# EAGLE design 003-UI (EAGLE 9.6.2)
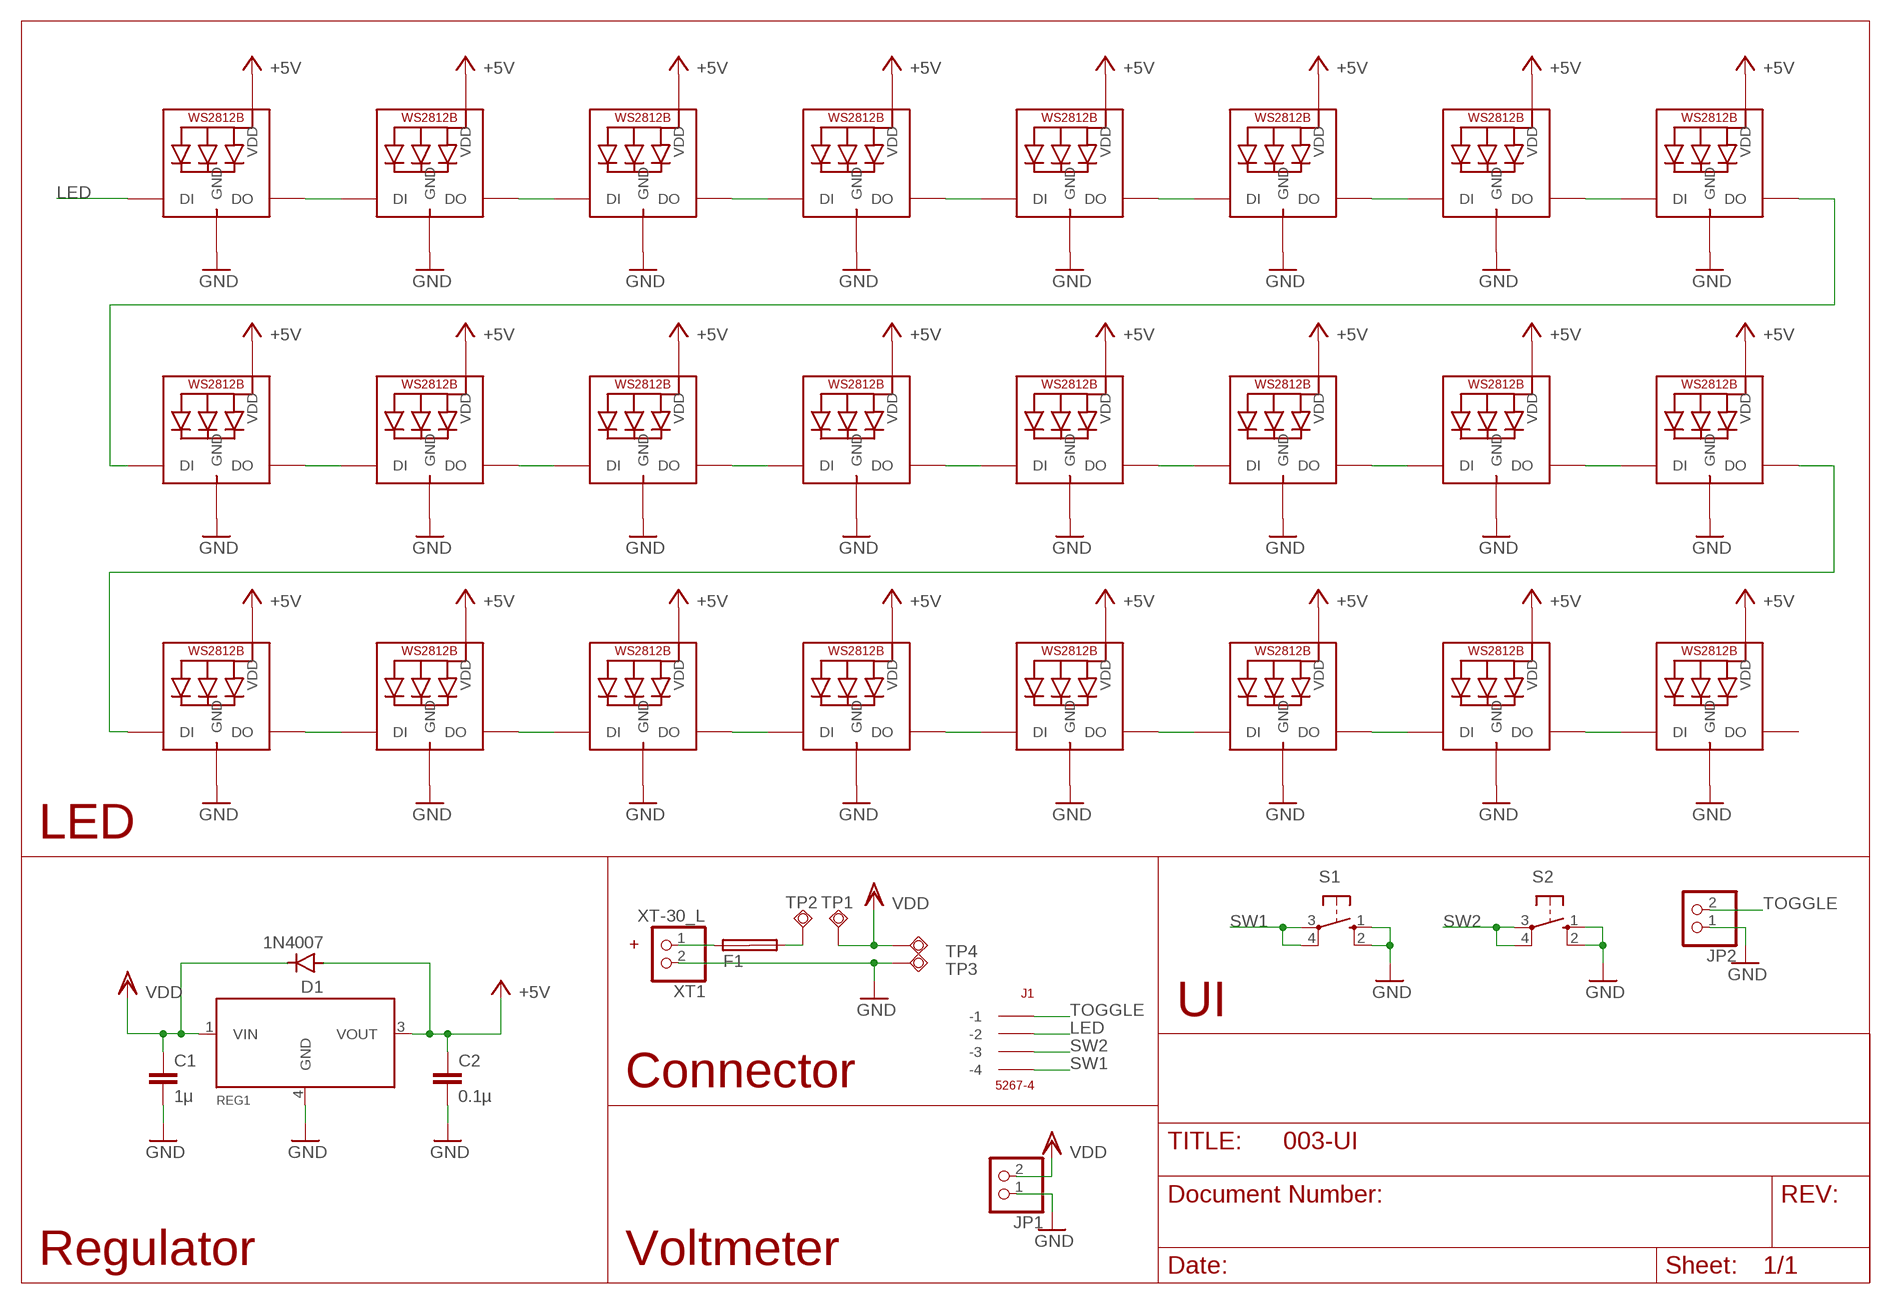
[diagram p0: schematic, sheet 1]

## Parts
C1  1μ  C-EUC0402  [C0402]
C2  0.1µ  C-EUC0402  [C0402]
D1  1N4007  GF1  [SMA-DO214AC]
F1  SHK20L  [SHK20L]
J1  5267-4  [5267-4]
JP1  PINHD-1X2  [1X02]
JP2  PINHD-1X2  [1X02]
LED1  WS2812B_2020  [WS2812B_2020]
LED2  WS2812B_2020  [WS2812B_2020]
LED3  WS2812B_2020  [WS2812B_2020]
LED4  WS2812B_2020  [WS2812B_2020]
LED5  WS2812B_2020  [WS2812B_2020]
LED6  WS2812B_2020  [WS2812B_2020]
LED7  WS2812B_2020  [WS2812B_2020]
LED8  WS2812B_2020  [WS2812B_2020]
LED9  WS2812B_2020  [WS2812B_2020]
LED10  WS2812B_2020  [WS2812B_2020]
LED11  WS2812B_2020  [WS2812B_2020]
LED12  WS2812B_2020  [WS2812B_2020]
LED13  WS2812B_2020  [WS2812B_2020]
LED14  WS2812B_2020  [WS2812B_2020]
LED15  WS2812B_2020  [WS2812B_2020]
LED16  WS2812B_2020  [WS2812B_2020]
LED17  WS2812B_2020  [WS2812B_2020]
LED18  WS2812B_2020  [WS2812B_2020]
LED19  WS2812B_2020  [WS2812B_2020]
LED20  WS2812B_2020  [WS2812B_2020]
LED21  WS2812B_2020  [WS2812B_2020]
LED22  WS2812B_2020  [WS2812B_2020]
LED23  WS2812B_2020  [WS2812B_2020]
LED24  WS2812B_2020  [WS2812B_2020]
REG1  MYPARTS_NJM7800S-REGULATOR  [MYPARTS_D-PAK_TO252AA]
S1  10-XX  [B3F-10XX]
S2  10-XX  [B3F-10XX]
TP1  TPSQPAD1-20  [P1-20]
TP2  TPSQPAD1-20  [P1-20]
TP3  TPSQPAD1-20  [P1-20]
TP4  TPSQPAD1-20  [P1-20]
XT1  XT-30_L  [XT-30_L]

## Nets
+5V: C2.1 D1.A LED1.4(VDD) LED2.4(VDD) LED3.4(VDD) LED4.4(VDD) LED5.4(VDD) LED6.4(VDD) LED7.4(VDD) LED8.4(VDD) LED9.4(VDD) LED10.4(VDD) LED11.4(VDD) LED12.4(VDD) LED13.4(VDD) LED14.4(VDD) LED15.4(VDD) LED16.4(VDD) LED17.4(VDD) LED18.4(VDD) LED19.4(VDD) LED20.4(VDD) LED21.4(VDD) LED22.4(VDD) LED23.4(VDD) LED24.4(VDD) REG1.3(VOUT)
GND: C1.2 C2.2 JP1.1 JP2.1 LED1.2(GND) LED2.2(GND) LED3.2(GND) LED4.2(GND) LED5.2(GND) LED6.2(GND) LED7.2(GND) LED8.2(GND) LED9.2(GND) LED10.2(GND) LED11.2(GND) LED12.2(GND) LED13.2(GND) LED14.2(GND) LED15.2(GND) LED16.2(GND) LED17.2(GND) LED18.2(GND) LED19.2(GND) LED20.2(GND) LED21.2(GND) LED22.2(GND) LED23.2(GND) LED24.2(GND) REG1.4(GND) S1.1(S) S1.2(S1) S2.1(S) S2.2(S1) TP3.TP XT1.2
LED: J1.P$2(-2) LED1.3(DI)
N$1: LED2.1(DO) LED3.3(DI)
N$2: F1.1A XT1.1
N$3: F1.2A TP2.TP
N$4: LED1.1(DO) LED2.3(DI)
N$5: LED3.1(DO) LED4.3(DI)
N$6: LED4.1(DO) LED5.3(DI)
N$7: LED5.1(DO) LED6.3(DI)
N$8: LED6.1(DO) LED7.3(DI)
N$9: LED7.1(DO) LED8.3(DI)
N$10: LED8.1(DO) LED9.3(DI)
N$11: LED9.1(DO) LED10.3(DI)
N$12: LED10.1(DO) LED11.3(DI)
N$13: LED11.1(DO) LED12.3(DI)
N$14: LED12.1(DO) LED13.3(DI)
N$15: LED13.1(DO) LED14.3(DI)
N$16: LED14.1(DO) LED15.3(DI)
N$17: LED15.1(DO) LED16.3(DI)
N$18: LED16.1(DO) LED17.3(DI)
N$19: LED17.1(DO) LED18.3(DI)
N$20: LED18.1(DO) LED19.3(DI)
N$21: LED19.1(DO) LED20.3(DI)
N$22: LED20.1(DO) LED21.3(DI)
N$23: LED21.1(DO) LED22.3(DI)
N$24: LED22.1(DO) LED23.3(DI)
N$25: LED23.1(DO) LED24.3(DI)
SW1: J1.P$4(-4) S1.3(P) S1.4(P1)
SW2: J1.P$3(-3) S2.3(P) S2.4(P1)
TOGGLE: J1.P$1(-1) JP2.2
VDD: C1.1 D1.K(C) JP1.2 REG1.1(VIN) TP1.TP TP4.TP
Unconnected: F1.1B F1.2B LED24.1(DO)

## Notes on the sheet
- LED
- UI
- Connector
- Regulator | Voltmeter

## Library data of the parts
C1 C2 = rcl:C-EU: CAPACITOR, European symbol; SPICEPREFIX: C
D1 = diode:GF1: DIODE
F1 = fuse:SHK20L: FUSE HOLDER 5 x 20 mm, SH contact, SHH1 Schukat, E1073 Buerklin; OC_FARNELL: unknown; OC_NEWARK: unknown
J1 = con-molex-spox:5267-4
JP1 JP2 = pinhead-compact:PINHD-1X2: PIN HEADER
LED1-LED24 = microbuilder:WS2812B
REG1 = #001-line:MYPARTS_NJM7800S-REGULATOR
S1 S2 = switch-omron:10-XX: OMRON SWITCH; MPN: B3F-1000; OC_FARNELL: 176432; OC_NEWARK: 36M3542
TP1-TP4 = testpad:TPSQ: Test pad
XT1 = XT-30:XT-30_L

## Net classes
0 default: width 0.406 mm

## Board
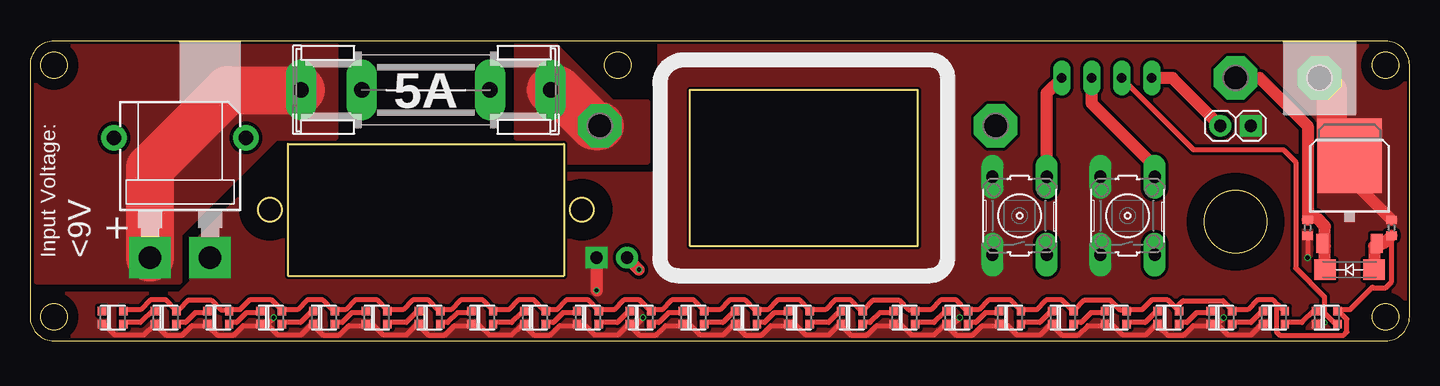
[diagram p1: board, top side]
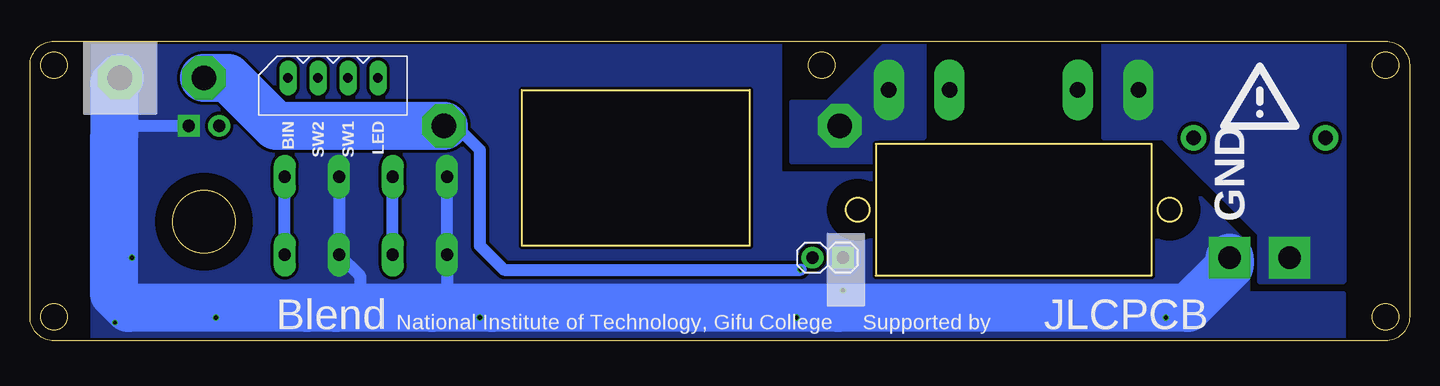
[diagram p2: board, bottom side, seen from below]

Size 115 x 25 mm. Coordinates in mm from the lower left corner, seen from the top.
Outline: 115,23 arc90 113,25 2,25 arc90 0,23 0,2 arc90 2,0 113,0 arc90 115,2 115,23
Outline: 55,7.93 74,7.93 74,20.93 55,20.93 55,7.93
Outline: 21.5,5.43 44.5,5.43 44.5,16.43 21.5,16.43 21.5,5.43
Outline: circle at 2,2 radius 1.1
Outline: circle at 2,23 radius 1.1
Outline: circle at 113,23 radius 1.1
Outline: circle at 20,10.93 radius 1
Outline: circle at 46,10.93 radius 1
Outline: circle at 113,2 radius 1.1
Outline: circle at 49,23 radius 1.1
Outline: circle at 100.5,9.93 radius 2.6
Copper layers (1*16): Top 0.035mm / dielectric 1.6mm / Bottom 0.035mm
Design rules "jlcpcb-2layers *": minimum track width 5mil, minimum drill 0.3mm, track to track 10mil, track to pad 5mil, pad to pad 5mil, via to via 5mil, smd to smd 5mil, copper to edge 0.2mm, drill to drill 6mil, minimum pad ring 10mil, minimum via ring 3mil, stop-mask expansion 4mil, vias tented up to drill 0mil, thermal gap 10mil
tRestrict: area 111,0 to 115,4; area 17.5,8.4 to 22.5,13.4; area 43.5,8.4 to 48.5,13.4; area 47,21 to 51,25; area 0,0 to 4,4; area 0,21 to 4,25; area 111,21 to 115,25; area 96.5,5.9 to 104.5,13.9
bRestrict: area 43.5,8.4 to 48.5,13.4; area 0,-0.6 to 5,25.4; area 110,-0.6 to 115,25.4; area 17.5,8.4 to 22.5,13.4; area 96.5,5.9 to 104.5,13.9; area 47,21 to 51,25

### Footprints (pad centres in the part's own frame; a part is rotated, then mirrored left to right if it is on the bottom)
C0402 = smd 0.7 x 0.9: 1 -0.65,0; 2 0.65,0
SMA-DO214AC = smd 1.8 x 1.7: A -2.05,0; K 2.05,0
SHK20L = drill 1.321 pad 2.54 long: 1A -10.414,0; 1B -5.334,0; 2A 10.414,0; 2B 5.334,0
5267-4 = drill 0.8 long: P$1 0,0; P$2 2.5,0; P$3 5,0; P$4 7.5,0
1X02 = drill 1.016 square: 1 -1.27,0 | drill 1.016: 2 1.27,0
WS2812B_2020 = smd 0.7 x 0.7: 1 0.9,-0.55; 2 0.9,0.55; 3 -0.9,0.55; 4 -0.9,-0.55
MYPARTS_D-PAK_TO252AA = smd 1 x 1.6: 1 -2.28,-4.8; 3 2.28,-4.8 | smd 5.4 x 6.2: 4 0,2.5
B3F-10XX = drill 1.016 long: 1 -3.251,2.261; 2 3.251,2.261; 3 -3.251,-2.261; 4 3.251,-2.261
P1-20 = drill 2.007 pad 3.15 octagon: TP 0,0
XT-30_L = drill 1.9 square: 1 3,-10; 2 8,-10 | drill 1.2: P$1 0,0; P$2 11,0

### Placement (x,y rotation side)
C1  106.5,9.43 270 top
C2  113.5,9.43 90 top
D1  110,5.93 180 top
F1  33,20.93 0 top
J1  93.5,21.93 0 bottom
JP1  48.5,6.93 180 bottom
JP2  100.5,17.93 180 top
LED1  108.1,1.93 180 top
LED2  103.7,1.93 180 top
LED3  99.3,1.93 180 top
LED4  94.9,1.93 180 top
LED5  90.5,1.93 180 top
LED6  86.1,1.93 180 top
LED7  81.7,1.93 180 top
LED8  77.3,1.93 180 top
LED9  72.9,1.93 180 top
LED10  68.5,1.93 180 top
LED11  64.1,1.93 180 top
LED12  59.7,1.93 180 top
LED13  55.3,1.93 180 top
LED14  50.9,1.93 180 top
LED15  46.5,1.93 180 top
LED16  42.1,1.93 180 top
LED17  37.7,1.93 180 top
LED18  33.3,1.93 180 top
LED19  28.9,1.93 180 top
LED20  24.5,1.93 180 top
LED21  20.1,1.93 180 top
LED22  15.7,1.93 180 top
LED23  11.3,1.93 180 top
LED24  6.9,1.93 180 top
REG1  110,12.93 0 top
S1  82.5,10.43 90 top
S2  91.5,10.43 90 top
TP1  80.5,17.93 0 top
TP2  47.5,17.93 0 top
TP3  107.5,21.93 0 top
TP4  100.5,21.93 0 top
XT1  7,16.93 0 top

### Tracks (layer width: path | path; a pad name or v marks a point on that pad's centre or on a via)
+5V
  Top 0.406: C2.1 113.5,4.93 113,4.43 112,4.43 111.91,4.46 110.04,2.59 109.24,2.59 LED1.4 109.24,2.33 109.77,1.79 109.77,0.73 109.51,0.46 104.17,0.46 103.91,0.73 103.91,2.86 104.04,2.99 | 104.04,2.99 104.44,2.59 LED2.4 | 104.04,2.99 103.64,3.39 102.31,3.39 101.5,2.59 100.44,2.59 LED3.4 100.17,2.59 99.44,3.33 96.1,3.33 95.5,2.73 | 95.5,2.73 95.64,2.59 LED4.4 | 95.5,2.73 94.84,3.39 93.5,3.39 92.7,2.59 91.64,2.59 LED5.4 91.37,2.59 90.84,2.59 90.04,3.39 87.9,3.39 87.1,2.59 LED6.4 86.84,2.59 86.04,3.39 84.7,3.39 83.9,2.59 82.84,2.59 LED7.4 82.57,2.59 81.77,3.39 79.9,3.39 79.1,2.59 78.3,2.59 LED8.4 78.04,2.59 77.24,3.39 75.9,3.39 75.1,2.59 74.03,2.59 LED9.4 73.77,2.59 73.23,2.59 72.44,3.39 70.3,3.39 69.5,2.59 LED10.4 69.23,2.59 68.44,3.39 67.1,3.39 66.3,2.59 65.23,2.59 LED11.4 64.97,2.59 64.17,3.39 62.3,3.39 61.5,2.59 60.7,2.59 LED12.4 60.43,2.59 59.63,3.39 58.3,3.39 57.5,2.59 56.43,2.59 LED13.4 56.17,2.59 55.37,3.39 53.5,3.39 52.7,2.59 51.9,2.59 LED14.4 51.63,2.59 50.83,3.39 49.5,3.39 48.7,2.59 47.63,2.59 LED15.4 47.37,2.59 46.56,3.39 44.7,3.39 43.9,2.59 43.1,2.59 LED16.4 42.83,2.59 42.03,3.39 40.7,3.39 39.9,2.59 38.83,2.59 LED17.4 38.56,2.59 37.76,3.39 35.9,3.39 35.1,2.59 34.3,2.59 LED18.4 34.03,2.59 33.23,3.39 31.9,3.39 31.1,2.59 30.03,2.59 LED19.4 29.76,2.59 28.96,3.39 27.1,3.39 26.3,2.59 25.5,2.59 LED20.4 25.23,2.59 24.43,3.39 23.1,3.39 22.3,2.59 21.23,2.59 LED21.4 20.96,2.59 20.16,3.39 18.3,3.39 17.49,2.59 16.7,2.59 LED22.4 16.43,2.59 15.9,2.59 15.09,3.39 13.23,3.39 12.43,2.59 LED23.4 12.16,2.59 11.36,3.39 10.03,3.39 9.23,2.59 7.89,2.59 LED24.4
  Top 1.016: D1.A 112.05,7.9 REG1.3 112.85,8.13 C2.1
GND  (via drill 0.3, 0.35)
  Top 0.406: 80.24,7.13 S1.1 | 6.1,1.28 LED24.2 6.29,1.26 7.09,0.46 9.49,0.46 10.29,1.26 LED23.2 10.56,1.26 11.36,0.46 12.69,0.46 13.49,1.26 14.56,1.26 LED22.2 14.83,1.26 15.63,0.46 16.96,0.46 17.76,1.26 19.09,1.26 LED21.2 | C1.2 v106.5,6.93 | v107.91,1.53 107.37,1.53 LED1.2 | LED3.2 98.57,1.26 99.1,1.26 99.91,0.46 101.77,0.46 102.57,1.26 LED2.2 | LED8.2 76.17,1.26 75.37,0.46 73.5,0.46 72.7,1.26 72.17,1.26 LED9.2 71.9,1.26 70.57,1.26 69.77,0.46 68.44,0.46 67.64,1.26 LED10.2 67.37,1.26 66.57,0.46 64.7,0.46 63.9,1.26 63.37,1.26 LED11.2 63.1,1.26 61.77,1.26 60.97,0.46 59.63,0.46 58.83,1.26 LED12.2 58.57,1.26 57.77,0.46 55.9,0.46 55.1,1.26 54.57,1.26 LED13.2 54.3,1.26 52.97,1.26 52.17,0.46 50.83,0.46 50.03,1.26 LED14.2 | LED14.2 49.77,1.26 48.97,0.46 47.1,0.46 46.3,1.26 45.77,1.26 LED15.2 45.5,1.26 44.16,1.26 43.37,0.46 42.03,0.46 41.23,1.26 LED16.2 40.97,1.26 40.16,0.46 38.3,0.46 37.5,1.26 36.96,1.26 LED17.2 36.7,1.26 35.36,1.26 34.56,0.46 33.23,0.46 32.43,1.26 LED18.2 32.16,1.26 31.36,0.46 29.5,0.46 28.7,1.26 28.16,1.26 LED19.2 27.9,1.26 26.56,1.26 25.76,0.46 24.43,0.46 23.63,1.26 LED20.2 23.36,1.26 22.56,0.46 20.7,0.46 19.9,1.26 19.36,1.26 LED21.2 | LED8.2 76.44,1.26 77.24,0.46 78.57,0.46 79.37,1.26 80.7,1.26 LED7.2 80.97,1.26 81.5,1.26 82.3,0.46 84.17,0.46 84.97,1.26 LED6.2 85.24,1.26 86.04,0.46 87.37,0.46 88.17,1.26 89.5,1.26 LED5.2 89.77,1.26 90.3,1.26 91.1,0.46 92.97,0.46 93.77,1.26 LED4.2 94.04,1.26 94.84,0.46 96.17,0.46 96.97,1.26 98.31,1.26 LED3.2 | LED3.2 98.95,1.38 v99.5,1.93 | LED14.2 50,1.41 | LED14.2 50.56,1.38 v51.12,1.93
  Top 0.406: LED8.2 76.95,1.38 v77.5,1.93 | LED21.2 19.77,1.38 v20.31,1.93
  Top 1.016: C2.2 110.5,13.08 110.5,14.93 REG1.4 | JP1.1 v47.23,4.2
  Top 2.54: REG1.4 108.5,16.93 108.5,20.93 TP3.TP
  Bottom 0.406: 91.9,2.33 91.9,2.73 | 47.5,4.46 47.63,4.46 47.63,2.73 | 106.5,7.93 106.57,7.93 108,7.93 | 89.5,4.19 89.5,2.73 | v107.91,1.53 106.8,2.73 | 108,7.13 106.57,7.13 v106.5,6.93 | 76.5,2.73 77.3,1.93 v77.5,1.93 | v51.12,1.93 51.5,1.93 | v20.31,1.93 20.5,1.93
  Bottom 1.016: S1.2 S1.1 80.24,3.99 81.5,2.73 | S2.2 S2.1 87.5,5.44 87.5,3.93 | v47.23,4.2 47.5,3.93 | JP2.1 107,17.93 108,16.93
  Bottom 4: XT1.2 15,6.23 18.5,2.73 47.63,2.73 76.5,2.73 81.5,2.73 89.5,2.73 91.9,2.73 106.8,2.73 108,3.93 108,7.13 108,7.93 108,16.93 108,21.43 TP3.TP
  pour Top (no thermals): -0.5,-1.07 -0.5,3.93 12.5,3.93 13.5,4.93 13.5,7.93 21.5,15.93 26.5,15.93 26.5,25.93 39.5,25.93 39.5,15.93 42.5,15.93 42.5,13.93 52.5,13.93 52.5,25.93 115.5,25.93 115.5,-1.07
  pour Bottom (no thermals): 5.5,-1.07 5.5,3.93 13.5,3.93 13.5,7.93 17.5,11.93 42.5,11.93 42.5,13.93 52.5,13.93 52.5,24.93 110.5,24.93 110.5,-1.07
LED
  Top 0.406: LED1.3 108.97,1.53 108.71,1.53 107.91,2.33 107.91,3.66 105.51,6.06 105.51,14.92 104.5,15.93 97,15.93 J1.P$2
N$1
  Top 0.406: LED3.3 100.44,1.53 101.77,1.53 102.57,2.33 LED2.1
N$2
  Top 4: XT1.1 10,14.43 16.5,20.93 F1.1A
  pour Top (no thermals): 12.5,4.93 12.5,8.93 20.5,16.93 25.5,16.93 25.5,25.93 4.5,25.93 0.5,21.93 0.5,4.93
  pour Bottom (no thermals): 12.5,4.93 12.5,8.93 20.5,16.93 25.5,16.93 25.5,25.93 5.5,25.93 5.5,4.93
N$3
  Top 4: F1.2A 44,20.93 47,17.93 TP2.TP
  pour Top (no thermals): 40.5,25.93 40.5,16.93 44.5,16.93 44.5,14.93 51.5,14.93 51.5,19.93 48.5,19.93 42.5,25.93
  pour Bottom (no thermals): 40.5,16.93 44.5,16.93 44.5,14.93 51.5,14.93 51.5,19.93 48.5,19.93 42.5,25.93 40.5,25.93
N$4
  Top 0.406: LED2.3 104.71,1.53 106.04,1.53 107.11,2.59 LED1.1
N$5
  Top 0.406: LED4.3 95.91,1.53 96.44,1.53 97.24,2.33 98.31,2.33 LED3.1
N$6
  Top 0.406: LED5.3 91.64,1.53 92.97,1.53 93.77,2.33 LED4.1
N$7
  Top 0.406: LED6.3 87.1,1.53 87.64,1.53 88.44,2.33 89.5,2.33 LED5.1
N$8
  Top 0.406: LED7.3 82.84,1.53 84.17,1.53 84.97,2.33 LED6.1
N$9
  Top 0.406: LED8.3 78.3,1.53 78.84,1.53 79.64,2.33 80.7,2.33 LED7.1
N$10
  Top 0.406: LED9.3 74.03,1.53 75.37,1.53 76.17,2.33 LED8.1
N$11
  Top 0.406: LED10.3 69.5,1.53 70.03,1.53 70.84,2.33 71.9,2.33 LED9.1
N$12
  Top 0.406: LED11.3 65.23,1.53 66.57,1.53 67.37,2.33 LED10.1
N$13
  Top 0.406: LED12.3 60.7,1.53 61.23,1.53 62.03,2.33 63.1,2.33 LED11.1
N$14
  Top 0.406: LED13.3 56.43,1.53 57.77,1.53 58.57,2.33 LED12.1
N$15
  Top 0.406: LED14.3 51.9,1.53 52.43,1.53 53.23,2.33 54.3,2.33 LED13.1
N$16
  Top 0.406: LED15.3 47.63,1.53 48.97,1.53 49.77,2.33 LED14.1
N$17
  Top 0.406: LED16.3 43.1,1.53 43.63,1.53 44.43,2.33 45.5,2.33 LED15.1
N$18
  Top 0.406: LED17.3 38.83,1.53 40.16,1.53 40.97,2.33 LED16.1
N$19
  Top 0.406: LED18.3 34.3,1.53 34.83,1.53 35.63,2.33 36.7,2.33 LED17.1
N$20
  Top 0.406: LED19.3 30.03,1.53 31.36,1.53 32.16,2.33 LED18.1
N$21
  Top 0.406: LED20.3 25.5,1.53 26.03,1.53 26.83,2.33 27.9,2.33 LED19.1
N$22
  Top 0.406: LED21.3 21.23,1.53 22.56,1.53 23.36,2.33 LED20.1
N$23
  Top 0.406: LED22.3 16.7,1.53 17.23,1.53 18.03,2.33 19.09,2.33 LED21.1
N$24
  Top 0.406: LED23.3 12.43,1.53 12.96,1.53 13.76,2.33 14.56,2.33 LED22.1
N$25
  Top 0.406: LED24.3 7.89,1.53 9.23,1.53 10.29,2.59 LED23.1
SW1
  Top 1.016: S1.4 84.76,20.69 J1.P$4
  Bottom 1.016: S1.3 S1.4
SW2
  Top 1.016: S2.4 93.76,14.53 88.5,19.79 J1.P$3
  Bottom 1.016: S2.3 S2.4
TOGGLE
  Top 1.016: JP2.2 95.23,21.93 J1.P$1
VDD  (via drill 0.35)
  Top 1.016: D1.K 107.95,7.9 | 107.95,7.9 107.95,9.53 107.21,10.26 106.69,10.26 C1.1 106.5,17.93 102.5,21.93 TP4.TP | 107.95,7.9 REG1.1 | v50.77,5.93 JP1.2
  Bottom 1.016: TP1.TP 79.5,17.93 77.5,15.93 77.5,7.93 75.5,5.93 v50.77,5.93
  Bottom 4: TP4.TP 98.5,21.93 94.5,17.93 TP1.TP

### Text on the board
tPlace: 5A | Input Voltage: | <9V
bPlace: LED | SW1 | SW2 | BIN | GND | JLCPCB | National Institute of Technology, Gifu College Supported by | Blend